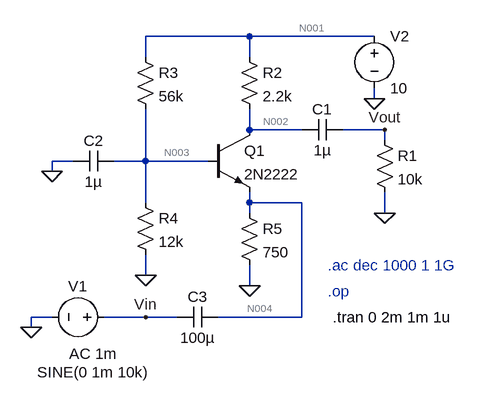
[diagram p0: schematic bjt_cb.asc]
bjt_cb.asc, the LTspice schematic file:
Version 4.1
SHEET 1 880 680
WIRE 208 -32 48 -32
WIRE 400 -32 208 -32
WIRE 48 0 48 -32
WIRE 208 0 208 -32
WIRE 400 64 400 48
WIRE 208 112 208 80
WIRE 288 112 208 112
WIRE 416 112 352 112
WIRE 416 128 416 112
WIRE -64 160 -96 160
WIRE 48 160 48 80
WIRE 48 160 0 160
WIRE 144 160 48 160
WIRE -96 176 -96 160
WIRE 48 224 48 160
WIRE 208 224 208 208
WIRE 288 224 208 224
WIRE 208 240 208 224
WIRE 416 240 416 208
WIRE 48 336 48 304
WIRE 208 352 208 320
WIRE -96 400 -128 400
WIRE 48 400 -16 400
WIRE 96 400 48 400
WIRE 288 400 288 224
WIRE 288 400 160 400
WIRE -128 416 -128 400
FLAG 416 240 0
FLAG 48 336 0
FLAG 208 352 0
FLAG -96 176 0
FLAG -128 416 0
FLAG 48 400 Vin
FLAG 400 64 0
FLAG 416 112 Vout
SYMBOL npn 144 112 R0
SYMATTR InstName Q1
SYMATTR Value 2N2222
SYMBOL cap 352 96 R90
WINDOW 0 0 32 VBottom 2
WINDOW 3 32 32 VTop 2
SYMATTR InstName C1
SYMATTR Value 1µ
SYMBOL res 400 112 R0
SYMATTR InstName R1
SYMATTR Value 10k
SYMBOL res 192 -16 R0
SYMATTR InstName R2
SYMATTR Value 2.2k
SYMBOL res 32 -16 R0
SYMATTR InstName R3
SYMATTR Value 56k
SYMBOL res 32 208 R0
SYMATTR InstName R4
SYMATTR Value 12k
SYMBOL res 192 224 R0
SYMATTR InstName R5
SYMATTR Value 750
SYMBOL cap 0 144 R90
WINDOW 0 0 32 VBottom 2
WINDOW 3 32 32 VTop 2
SYMATTR InstName C2
SYMATTR Value 1µ
SYMBOL voltage 0 400 R90
WINDOW 0 -32 56 VBottom 2
WINDOW 3 69 33 VTop 2
WINDOW 123 41 33 VTop 2
WINDOW 39 0 0 Left 0
SYMATTR InstName V1
SYMATTR Value SINE(0 1m 10k)
SYMATTR Value2 AC 1m
SYMBOL voltage 400 -48 R0
WINDOW 123 0 0 Left 0
WINDOW 39 0 0 Left 0
SYMATTR InstName V2
SYMATTR Value 10
SYMBOL cap 160 384 R90
WINDOW 0 0 32 VBottom 2
WINDOW 3 32 32 VTop 2
SYMATTR InstName C3
SYMATTR Value 100µ
TEXT 328 320 Left 2 ;.ac dec 1000 1 1G
TEXT 328 360 Left 2 ;.op
TEXT 336 400 Left 2 !.tran 0 2m 1m 1u

The netlist it stands for:
* bjt_cb.asc
Q1 N002 N003 N004 0 2N2222
C1 Vout N002 1µ
R1 Vout 0 10k
R2 N001 N002 2.2k
R3 N001 N003 56k
R4 N003 0 12k
R5 N004 0 750
C2 N003 0 1µ
V1 Vin 0 SINE(0 1m 10k) AC 1m
V2 N001 0 10
C3 N004 Vin 100µ
.model NPN NPN
.model PNP PNP
.lib standard.bjt
* .ac dec 1000 1 1G
* .op
.tran 0 2m 1m 1u
.backanno
.end

* Results of the author's LTspice run, read from the files saved beside the schematic
* Operating Point, zero values left out:
*   V(n003) = 1.7 V
*   V(n001) = 10 V
*   V(n002) = 6.972 V
*   V(n004) = 1.037 V
*   Ic(Q1) = 1.377 mA
*   Ib(Q1) = 6.566 µA
*   Ie(Q1) = -1.383 mA
*   I(R3) = 148.2 µA
*   I(R4) = 141.7 µA
*   I(R2) = 1.377 mA
*   I(R5) = 1.383 mA
*   I(V2) = -1.525 mA
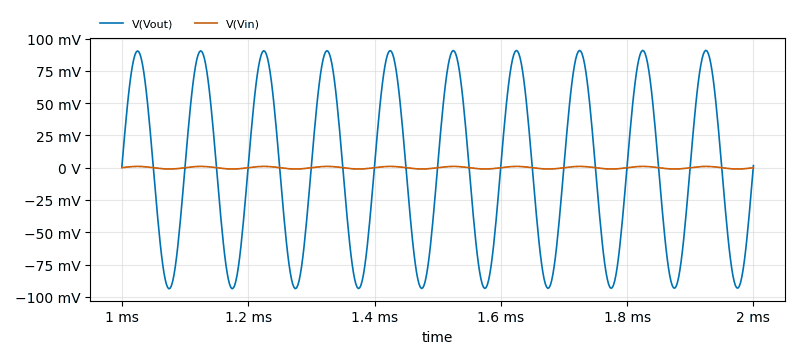
[diagram p1: Transient Analysis of bjt_cb.asc, plotted from the saved traces]
* Transient Analysis, 1 run:
*   V(Vout): min -93.78 mV, max 90.89 mV, average -597.5 µV, rms 65.14 mV, last 1.642 mV
*   V(Vin): min -999.5 µV, max 999.5 µV, average 3.273 nV, rms 707.2 µV, last 0 V